# Altium schematic sheet TOP_LEVEL.SchDoc
size A4; SheetNumber: 1; SheetTotal: 7
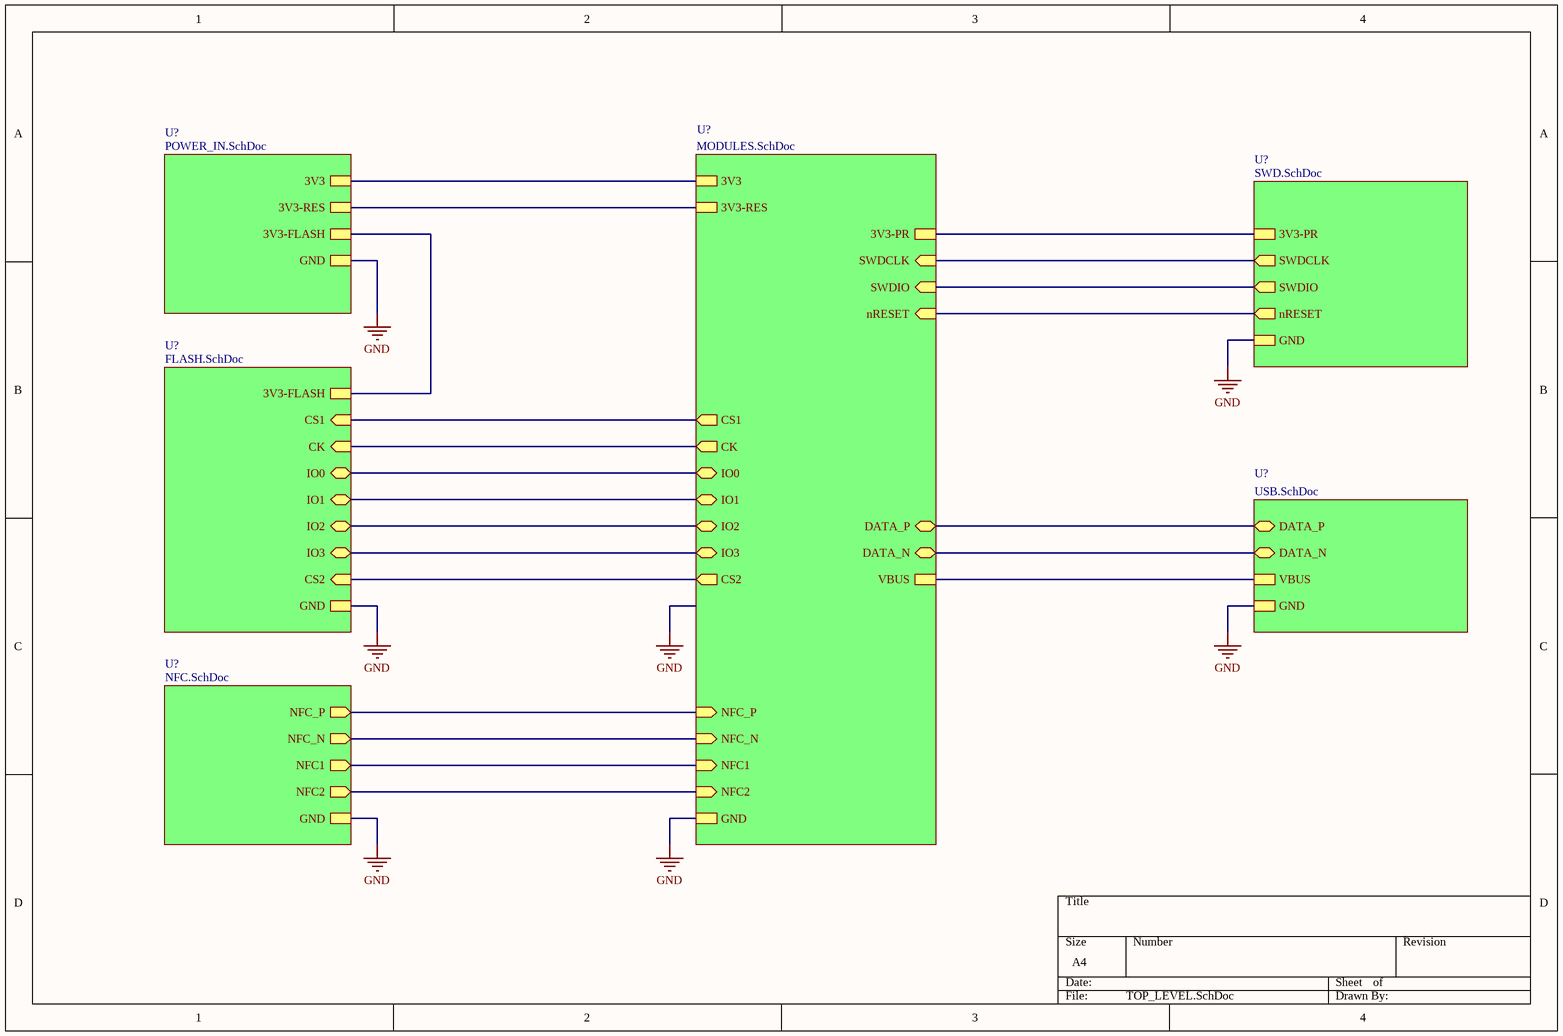
[diagram p0: TOP_LEVEL.SchDoc]

## Sub-sheets
U? = POWER_IN.SchDoc: GND, 3V3, 3V3-RES, 3V3-FLASH
U? = MODULES.SchDoc: SWDCLK (in), SWDIO (in), nRESET (in), CS1 (out), CK (out), IO0 (bidir), IO1 (bidir), IO2 (bidir), NFC1 (in), NFC2 (in), NFC_N (in), NFC_P (in), GND, 3V3, 3V3-RES, 3V3-PR, VBUS, DATA_P (bidir), DATA_N (bidir), IO3 (bidir), CS2 (out)
U? = SWD.SchDoc: SWDCLK (out), SWDIO (out), nRESET (out), GND, 3V3-PR
U? = FLASH.SchDoc: CS1 (in), CK (in), IO0 (bidir), IO1 (bidir), IO2 (bidir), GND, 3V3-FLASH, IO3 (bidir), CS2 (in)
U? = USB.SchDoc: GND, VBUS, DATA_P (bidir), DATA_N (bidir)
U? = NFC.SchDoc: NFC_P (out), NFC_N (out), NFC1 (out), NFC2 (out), GND

## Nets
GND: sheet U?/GND, sheet U?/GND, sheet U?/GND, sheet U?/GND, sheet U?/GND, sheet U?/GND
(unnamed): sheet U?/3V3, sheet U?/3V3
(unnamed): sheet U?/3V3-RES, sheet U?/3V3-RES
(unnamed): sheet U?/3V3-FLASH, sheet U?/3V3-FLASH
(unnamed): sheet U?/SWDCLK, sheet U?/SWDCLK
(unnamed): sheet U?/SWDIO, sheet U?/SWDIO
(unnamed): sheet U?/nRESET, sheet U?/nRESET
(unnamed): sheet U?/CS1, sheet U?/CS1
(unnamed): sheet U?/CK, sheet U?/CK
(unnamed): sheet U?/IO0, sheet U?/IO0
(unnamed): sheet U?/IO1, sheet U?/IO1
(unnamed): sheet U?/IO2, sheet U?/IO2
(unnamed): sheet U?/NFC1, sheet U?/NFC1
(unnamed): sheet U?/NFC2, sheet U?/NFC2
(unnamed): sheet U?/NFC_N, sheet U?/NFC_N
(unnamed): sheet U?/NFC_P, sheet U?/NFC_P
(unnamed): sheet U?/3V3-PR, sheet U?/3V3-PR
(unnamed): sheet U?/VBUS, sheet U?/VBUS
(unnamed): sheet U?/DATA_P, sheet U?/DATA_P
(unnamed): sheet U?/DATA_N, sheet U?/DATA_N
(unnamed): sheet U?/IO3, sheet U?/IO3
(unnamed): sheet U?/CS2, sheet U?/CS2